# Altium schematic sheet Sheet_1_2023-11-25.schdoc
size 87 x 124 mm
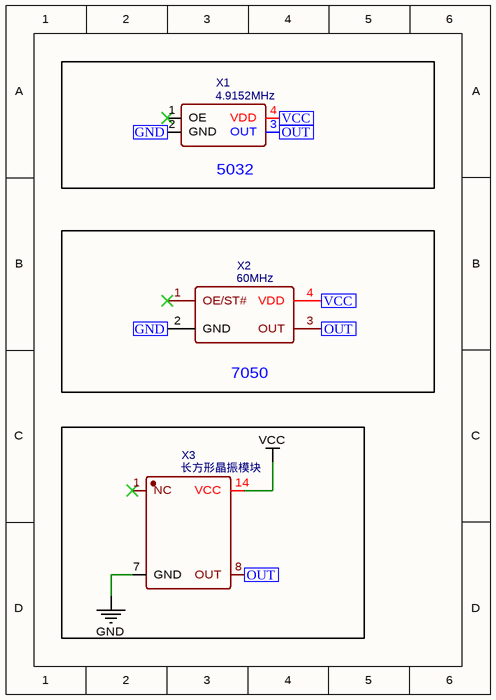
[diagram p0: Sheet_1_2023-11-25.schdoc]

## Parts
X1  4.9152MHz  [OSC-SMD_4P-L5.0-W3.2-BL_SIT1602AI]
X2  60MHz  [OSC-SMD_4P-L7.0-W5.0-BL]
X3  长方形晶振模块  [长方形晶振模块]

## Blocks framed on the sheet
5032: X1
7050: X2

## Ports
GND (in), OUT (in), VCC (in)

## Nets
GND: X3.7(GND)
VCC: X3.14(VCC)
GND: X1.2(GND) X2.2(GND) ; port GND  [a separate net that carries the same name]
OUT: X1.3(OUT) X2.3(OUT) X3.8(OUT) ; port OUT
VCC: X1.4(VDD) X2.4(VDD) ; port VCC  [a separate net that carries the same name]

Not connected (* = marked no-connect by the designer): X1 1(OE)*; X2 1(OE/ST#)*; X3 1(NC)*

## Library data of the parts
X1 = 4.9152MHz: Manufacturer: YXC(扬兴晶振); Manufacturer Part: O503249152MEDH4MI-1; nameAlias: Value; Supplier: LCSC; Supplier Part: C88104; JLCPCB Part Class: Extended Part; link: https://so.szlcsc.com/global.html?k=C88104&ref=editor; spicePre: X; spiceSymbolName: O503249152MEDH4MI-1
X2 = 60MHz: Manufacturer Part: SIT1602AI-82-33E-60.000000Y; Manufacturer: SITIME; nameAlias: Value; Supplier: LCSC; Supplier Part: C26255; JLCPCB Part Class: Extended Part; link: https://so.szlcsc.com/global.html?k=C26255&ref=editor; spicePre: X; spiceSymbolName: SIT1602AI-82-33E-60.000000Y
X3 = 长方形晶振模块: Contributor: denjhang; spicePre: X; spiceSymbolName: 长方形晶振模块